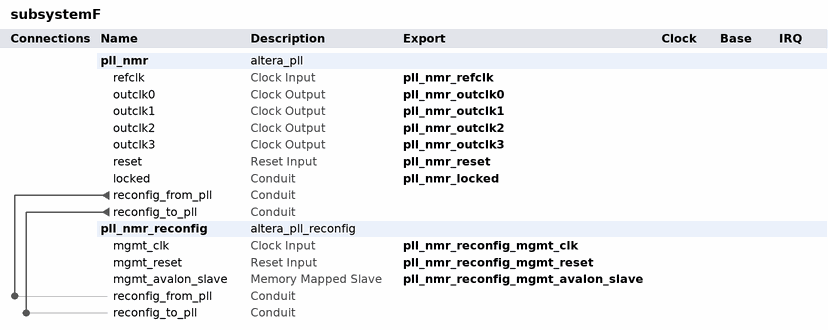
[diagram p0: system contents]
# Platform Designer (Qsys) system subsystemF, Cyclone V 5CSEMA5F31C6
# Parameters at their usual value, and those the tool derives, are not listed.
package require -exact qsys 16.1
create_system subsystemF
set_project_property DEVICE_FAMILY {Cyclone V}
set_project_property DEVICE 5CSEMA5F31C6

add_instance pll_nmr altera_pll 16.1
set_instance_parameter_value pll_nmr gui_device_speed_grade 1
set_instance_parameter_value pll_nmr gui_en_reconf true
set_instance_parameter_value pll_nmr gui_number_of_clocks 4
set_instance_parameter_value pll_nmr gui_operation_mode direct
set_instance_parameter_value pll_nmr gui_output_clock_frequency0 4.3
set_instance_parameter_value pll_nmr gui_output_clock_frequency1 4.3
set_instance_parameter_value pll_nmr gui_output_clock_frequency2 4.3
set_instance_parameter_value pll_nmr gui_output_clock_frequency3 4.3
set_instance_parameter_value pll_nmr gui_pll_mode {Fractional-N PLL}
set_instance_parameter_value pll_nmr gui_reference_clock_frequency 50.0
set_instance_parameter_value pll_nmr gui_use_locked true

add_instance pll_nmr_reconfig altera_pll_reconfig 16.1

# connections
add_connection pll_nmr.reconfig_from_pll pll_nmr_reconfig.reconfig_from_pll conduit
add_connection pll_nmr.reconfig_to_pll pll_nmr_reconfig.reconfig_to_pll conduit

# exported interfaces
add_interface pll_nmr_locked conduit end
set_interface_property pll_nmr_locked EXPORT_OF pll_nmr.locked
add_interface pll_nmr_outclk0 clock source
set_interface_property pll_nmr_outclk0 EXPORT_OF pll_nmr.outclk0
add_interface pll_nmr_outclk1 clock source
set_interface_property pll_nmr_outclk1 EXPORT_OF pll_nmr.outclk1
add_interface pll_nmr_outclk2 clock source
set_interface_property pll_nmr_outclk2 EXPORT_OF pll_nmr.outclk2
add_interface pll_nmr_outclk3 clock source
set_interface_property pll_nmr_outclk3 EXPORT_OF pll_nmr.outclk3
add_interface pll_nmr_reconfig_mgmt_avalon_slave avalon slave
set_interface_property pll_nmr_reconfig_mgmt_avalon_slave EXPORT_OF pll_nmr_reconfig.mgmt_avalon_slave
add_interface pll_nmr_reconfig_mgmt_clk clock sink
set_interface_property pll_nmr_reconfig_mgmt_clk EXPORT_OF pll_nmr_reconfig.mgmt_clk
add_interface pll_nmr_reconfig_mgmt_reset reset sink
set_interface_property pll_nmr_reconfig_mgmt_reset EXPORT_OF pll_nmr_reconfig.mgmt_reset
add_interface pll_nmr_refclk clock sink
set_interface_property pll_nmr_refclk EXPORT_OF pll_nmr.refclk
add_interface pll_nmr_reset reset sink
set_interface_property pll_nmr_reset EXPORT_OF pll_nmr.reset

set_interconnect_requirement {$system} qsys_mm.clockCrossingAdapter HANDSHAKE
set_interconnect_requirement {$system} qsys_mm.enableEccProtection FALSE
set_interconnect_requirement {$system} qsys_mm.insertDefaultSlave FALSE
set_interconnect_requirement {$system} qsys_mm.maxAdditionalLatency 1

save_system subsystemF.qsys
